# Altium schematic sheet CH32X033F-R0.SchDoc
size 304 x 254 mm
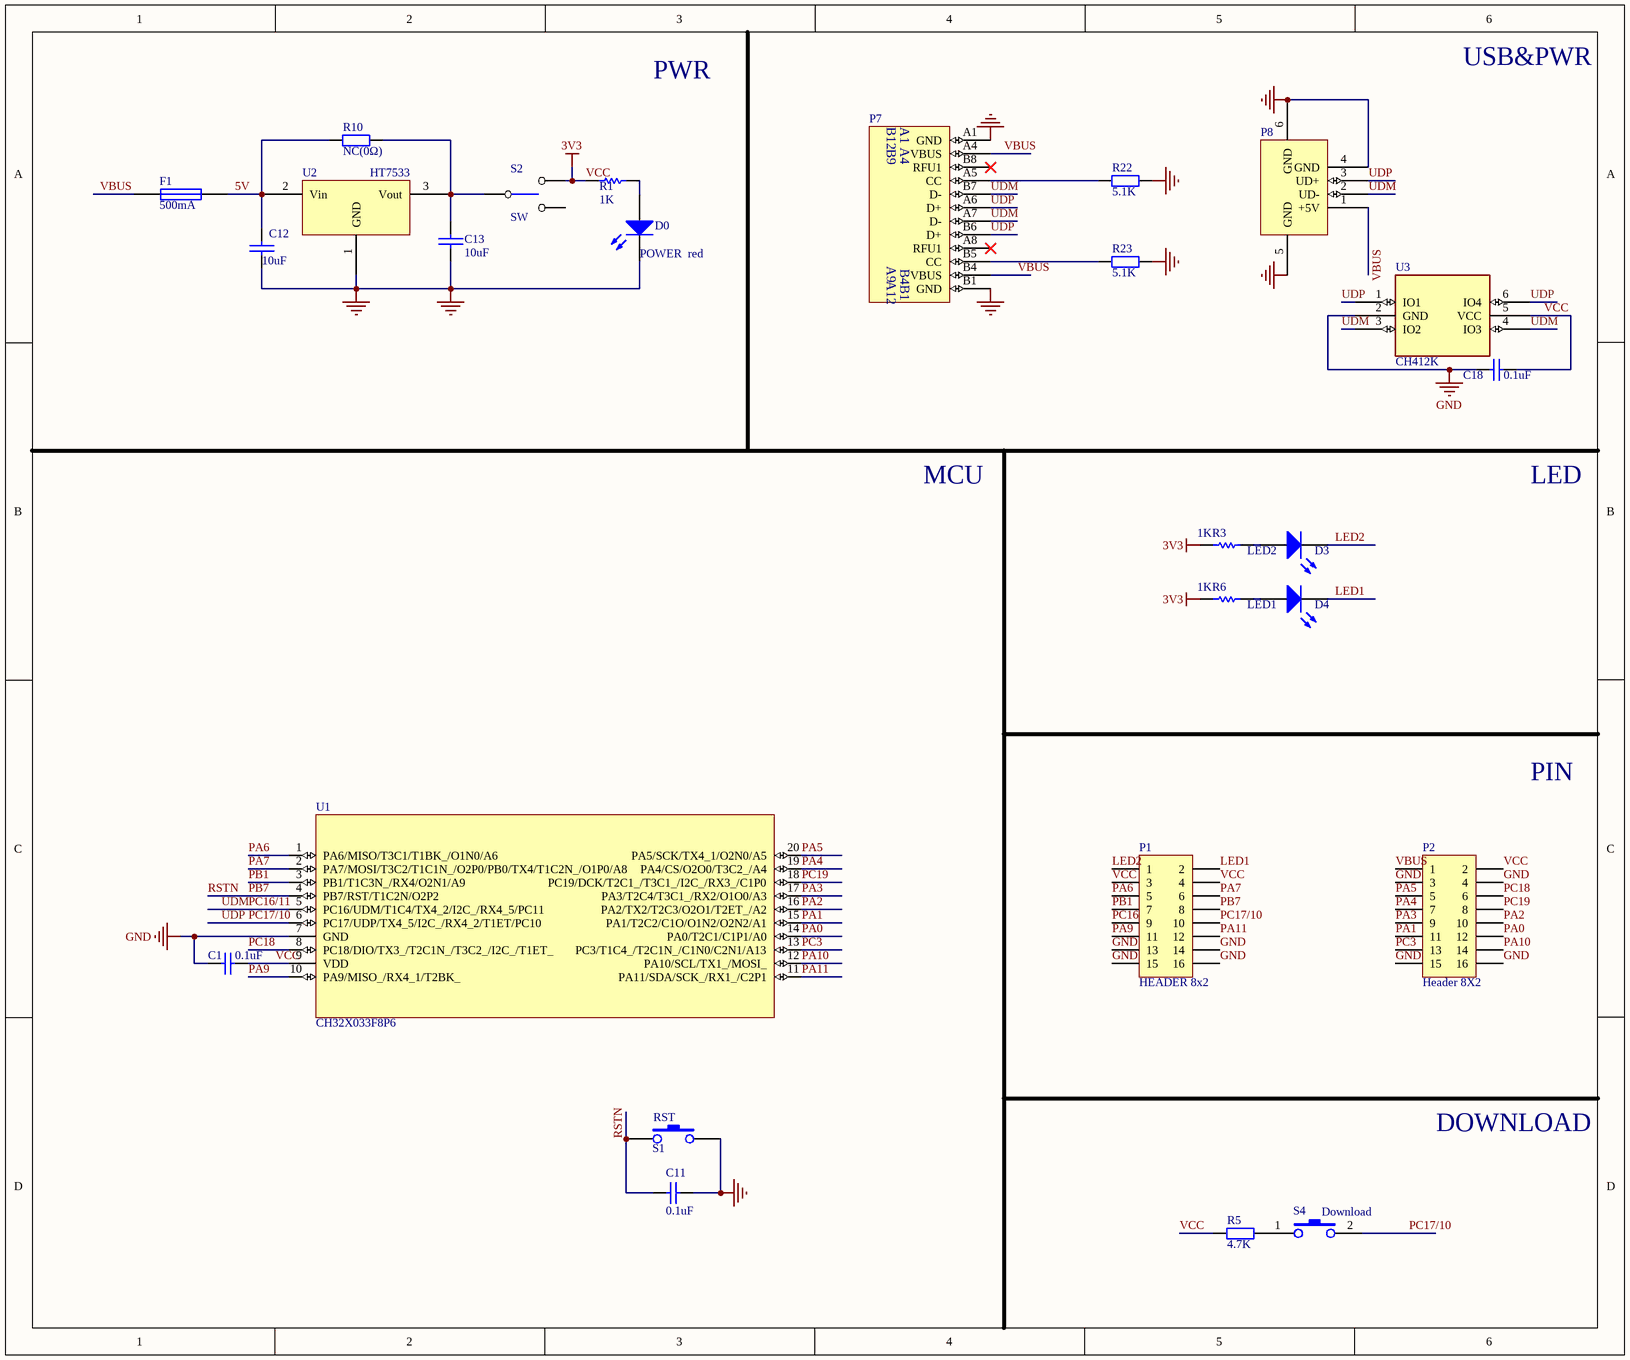
[diagram p0: CH32X033F-R0.SchDoc]

## Parts
C1  0.1uF  [0603_C]
C11  0.1uF  [0603_C]
C12  10uF  [0603_C]
C13  10uF  [0603_C]
C18  0.1uF  [0603_C]
D0  POWER  red  [0603+]
D3  LED2  [0603+]
D4  LED1  [0603+]
F1  500mA  [0603]
P1  HEADER 8x2  [IDC16-2.54mm]
P2  Header 8X2  [IDC16-2.54mm]
P7  TYPE-C  [TYPE-C-Receptacle-2.0]  (value not drawn)
P8  USB_A  [USBAF]  (value not drawn)
R1  1K  [0603]
R3  1K  [0603]
R5  4.7K  [0603]
R6  1K  [0603]
R10  NC(0Ω)  [0603]
R22  5.1K  [0603]
R23  5.1K  [0603]
S1  RST  [SMD_6.1x3.65x2.5mm-KEY]
S2  SW  [SW1]
S4  Download  [SMD_6.1x3.65x2.5mm-KEY]
U1  CH32X033F8P6  [TSSOP20]
U2  HT7533  [SOT-89]
U3  CH412K  [SOT-363]

## Nets
GND: C1.2 C11.1 C12.2 C13.2 C18.1 D0.2(K) P1.13 P1.14 P1.15 P1.16 P2.3 P2.4 P2.15 P2.16 P7.A1(GND) P7.B1(GND) P8.4(GND) P8.5(GND) P8.6(GND) R22.2 R23.2 S1.2 U1.7(GND) U2.1(GND) U3.2(GND)
VCC: C1.1 C18.2 P1.3 P1.4 P2.2 R1.2 R3.1 R5.1 R6.1 S2.3 U1.9(VDD) U3.5(VCC)  [also labelled 3V3]
5V: C12.1 F1.2 R10.2 U2.2(Vin)
LED1: D4.2(K) P1.2
LED2: D3.2(K) P1.1
PA0: P2.12 U1.14(PA0/T2C1/C1P1/A0)
PA1: P2.11 U1.15(PA1/T2C2/C1O/O1N2/O2N2/A1)
PA2: P2.10 U1.16(PA2/TX2/T2C3/O2O1/T2ET_/A2)
PA3: P2.9 U1.17(PA3/T2C4/T3C1_/RX2/O1O0/A3)
PA4: P2.7 U1.19(PA4/CS/O2O0/T3C2_/A4)
PA5: P2.5 U1.20(PA5/SCK/TX4_1/O2N0/A5)
PA6: P1.5 U1.1(PA6/MISO/T3C1/T1BK_/O1N0/A6)
PA7: P1.6 U1.2(PA7/MOSI/T3C2/T1C1N_/O2P0/PB0/TX4/T1C2N_/O1P0/A8)
PA9: P1.11 U1.10(PA9/MISO_/RX4_1/T2BK_)
PA10: P2.14 U1.12(PA10/SCL/TX1_/MOSI_)
PA11: P1.12 U1.11(PA11/SDA/SCK_/RX1_/C2P1)
PB1: P1.7 U1.3(PB1/T1C3N_/RX4/O2N1/A9)
PB7: C11.2 P1.8 S1.1 U1.4(PB7/RST/T1C2N/O2P2)  [also labelled RSTN]
PC3: P2.13 U1.13(PC3/T1C4_/T2C1N_/C1N0/C2N1/A13)
PC16/11: P1.9 P7.A7(D-) P7.B7(D-) P8.2(UD-) U1.5(PC16/UDM/T1C4/TX4_2/I2C_/RX4_5/PC11) U3.3(IO2) U3.4(IO3)  [also labelled UDM]
PC17/10: P1.10 P7.A6(D+) P7.B6(D+) P8.3(UD+) S4.2 U1.6(PC17/UDP/TX4_5/I2C_/RX4_2/T1ET/PC10) U3.1(IO1) U3.6(IO4)  [also labelled UDP]
PC18: P2.6 U1.8(PC18/DIO/TX3_/T2C1N_/T3C2_/I2C_/T1ET_)
PC19: P2.8 U1.18(PC19/DCK/T2C1_/T3C1_/I2C_/RX3_/C1P0)
VBUS: F1.1 P2.1 P7.A4(VBUS) P7.B4(VBUS) P8.1(+5V)
NetC13_1: C13.1 R10.1 S2.1 U2.3(Vout)
NetD0_1: D0.1(A) R1.1
NetD3_1: D3.1(A) R3.2
NetD4_1: D4.1(A) R6.2
NetP7_A5: P7.A5(CC) R22.1
NetP7_B5: P7.B5(CC) R23.1
NetR5_2: R5.2 S4.1

Not connected (* = marked no-connect by the designer): P7 A8(RFU1)* B8(RFU1)*; S2 2

## Notes on the sheet
- PWR
- USB&PWR
- MCU
- LED
- PIN
- DOWNLOAD
- (in symbol TYPE-C1) B12; B9; A9; A12

## Library data of the parts
C1 C11 C18 = Cap: Capacitor
C12 C13 = CAP: Capacitor
D0 D3 D4 = LED0: Typical INFRARED GaAs LED; Published: 8-Jun-2000; LatestRevisionDate: 08-Jul-2005; LatestRevisionNote: Mech Layer 1 removed.; PackageReference: LED-0; Publisher: Altium Limited
F1 = FUSE1: Fuse
P1 = HEADER 8x2: Header, 8-Pin, Dual row
P2 = Header 8X2: Header, 8-Pin, Dual row; LatestRevisionDate: 17-Jul-2002; LatestRevisionNote: Re-released for DXP Platform.; Publisher: Altium Limited
P7 = TYPE-C1
P8 = USB: USB Port
R1 R3 R6 = Res Semi: Semiconductor Resistor
R5 R10 R22 R23 = Res2: Resistor
S1 = KEY
S4 = KEY1
U1 = CH32X033F8P6: RISC-V MCU with USB/ADC/SPI/I2C/UART*4/OA*2/CMP*2
U2 = 1117-3.3V
U3 = CH412K: Qaud ESD protect, high speed